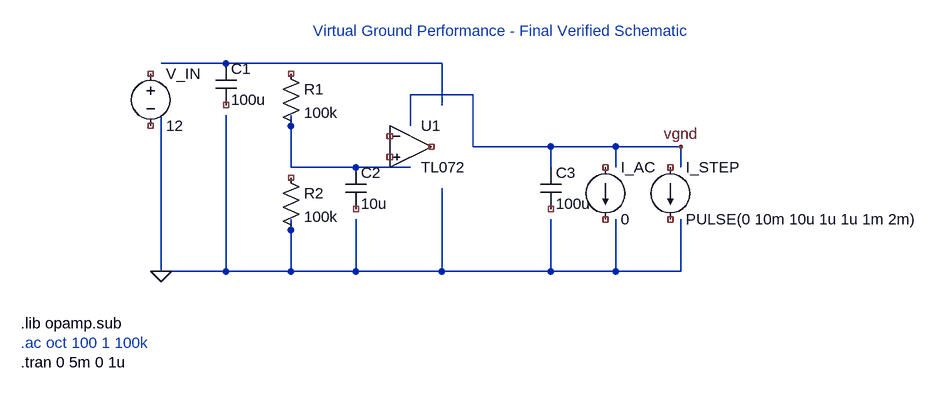
[diagram p0: schematic Virtual_Ground.asc]
Virtual_Ground.asc, the LTspice schematic file:
Version 4.1
SHEET 1 1200 800
WIRE 116 0 16 0
WIRE 216 0 116 0
WIRE 448 0 216 0
WIRE 116 320 16 320
WIRE 216 320 116 320
WIRE 316 320 216 320
WIRE 448 320 316 320
WIRE 616 320 448 320
WIRE 716 320 616 320
WIRE 816 320 716 320
WIRE 16 80 16 320
WIRE 116 80 116 320
WIRE 216 80 216 160
WIRE 216 240 216 320
WIRE 316 160 216 160
WIRE 316 240 316 320
WIRE 400 160 316 160
WIRE 448 64 448 0
WIRE 448 192 448 320
WIRE 400 96 400 48
WIRE 496 48 400 48
WIRE 496 128 496 48
WIRE 616 128 496 128
WIRE 616 160 616 128
WIRE 616 240 616 320
WIRE 716 128 616 128
WIRE 716 160 716 128
WIRE 716 240 716 320
WIRE 816 128 716 128
WIRE 816 160 816 128
WIRE 816 240 816 320
FLAG 16 320 0
FLAG 816 128 vgnd
SYMBOL voltage 0 0 R0
SYMATTR InstName V_IN
SYMATTR Value 12
SYMBOL cap 100 0 R0
SYMATTR InstName C1
SYMATTR Value 100u
SYMBOL res 200 0 R0
SYMATTR InstName R1
SYMATTR Value 100k
SYMBOL res 200 160 R0
SYMATTR InstName R2
SYMATTR Value 100k
SYMBOL cap 300 160 R0
SYMATTR InstName C2
SYMATTR Value 10u
SYMBOL OpAmps\\opamp 400 64 R0
SYMATTR InstName U1
SYMATTR Value TL072
SYMBOL cap 600 160 R0
SYMATTR InstName C3
SYMATTR Value 100u
SYMBOL current 700 160 R0
SYMATTR InstName I_AC
SYMATTR Value 0
SYMATTR Value2 AC 1
SYMBOL current 800 160 R0
SYMATTR InstName I_STEP
SYMATTR Value PULSE(0 10m 10u 1u 1u 1m 2m)
TEXT -200 400 Left 2 !.lib opamp.sub
TEXT -200 430 Left 2 ;.ac oct 100 1 100k
TEXT -200 460 Left 2 !.tran 0 5m 0 1u
TEXT 250 -50 Left 2 ;Virtual Ground Performance - Final Verified Schematic

The netlist it stands for:
* Virtual_Ground.asc
V_IN NC_01 NC_02 12
C1 N001 NC_03 100u
R1 NC_04 N002 100k
R2 NC_05 0 100k
C2 N002 NC_06 10u
X§U1 NC_07 NC_08 NC_09 TL072 Aol=100K GBW=10Meg  ; pins invin noninvin out
C3 vgnd NC_10 100u
I_AC NC_11 NC_12 0 AC 1
I_STEP NC_13 NC_14 PULSE(0 10m 10u 1u 1u 1m 2m)
.lib opamp.sub
* .ac oct 100 1 100k
.tran 0 5m 0 1u
* Virtual Ground Performance - Final Verified Schematic
.backanno
.end